# Altium project MRTRUMAN.PrjPcb (part 4 of 4)

## Sheet 07 Audio.SchDoc
size A
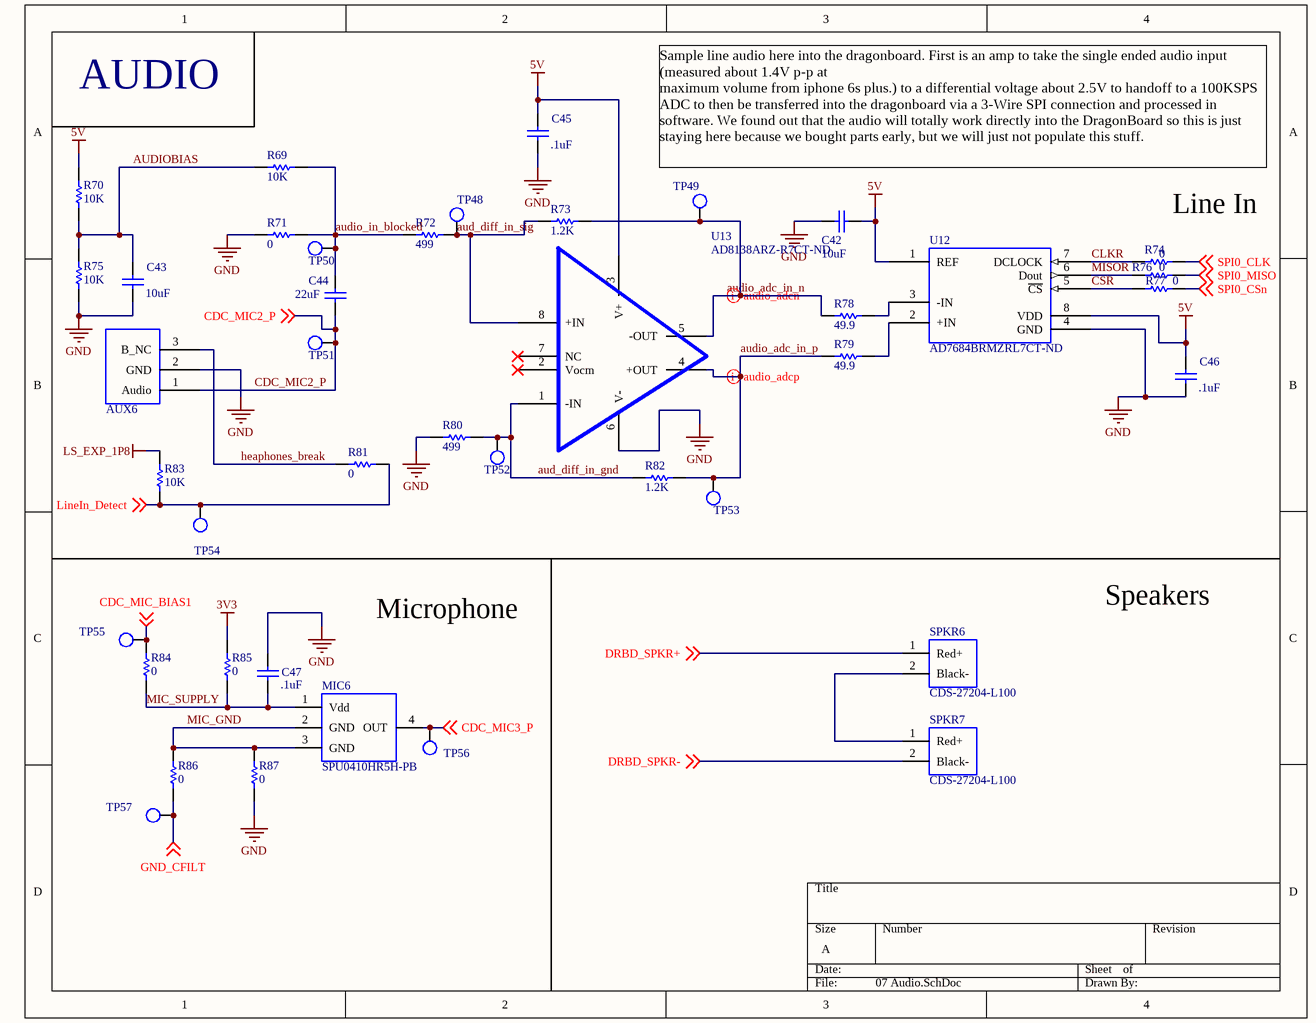
[diagram p6: 07 Audio.SchDoc]

### Parts
AUX6  CP-3523MJCT-ND  [Audio_Conn_Mono]  (value not drawn)
C42  value 10uF  [CAPC2012X135N]  (hidden comment: CAP_0805_10u_16V)
C43  value 10uF  [CAPC2012X135N]  (hidden comment: CAP_0805_10u_16V)
C44  value 22uF  [CAPC2012X135N]  (hidden comment: CAP_0805_22u_25V_BLOCK)
C45  value .1uF  [CAPC2012X135N]  (hidden comment: CAP_0805_.1u_250V)
C46  value .1uF  [CAPC2012X135N]  (hidden comment: CAP_0805_.1u_250V)
C47  value .1uF  [CAPC2012X135N]  (hidden comment: CAP_0805_.1u_250V)
MIC6  SPU0410HR5H-PB  [MIC_FP]
R69  Resistance: 10K  [RES0805]  (hidden comment: RES_0805_10K)
R70  Resistance: 10K  [RES0805]  (hidden comment: RES_0805_10K)
R71  RES_0805_JMP  [RES0805]  (value not drawn)
R72  Resistance: 499  [RES0805]  (hidden comment: RES_0805_499)
R73  Resistance: 1.2K  [RES0805]  (hidden comment: RES_0805_1.2K)
R74  RES_0805_JMP  [RES0805]  (value not drawn)
R75  Resistance: 10K  [RES0805]  (hidden comment: RES_0805_10K)
R76  RES_0805_JMP  [RES0805]  (value not drawn)
R77  RES_0805_JMP  [RES0805]  (value not drawn)
R78  Resistance: 49.9  [RES0805]  (hidden comment: RES_0805_49.9)
R79  Resistance: 49.9  [RES0805]  (hidden comment: RES_0805_49.9)
R80  Resistance: 499  [RES0805]  (hidden comment: RES_0805_499)
R81  RES_0805_JMP  [RES0805]  (value not drawn)
R82  Resistance: 1.2K  [RES0805]  (hidden comment: RES_0805_1.2K)
R83  Resistance: 10K  [RES0805]  (hidden comment: RES_0805_10K)
R84  RES_0805_JMP  [RES0805]  (value not drawn)
R85  RES_0805_JMP  [RES0805]  (value not drawn)
R86  RES_0805_JMP  [RES0805]  (value not drawn)
R87  RES_0805_JMP  [RES0805]  (value not drawn)
SPKR6  CDS-27204-L100  [PHOENIX_2POS_1935161]
SPKR7  CDS-27204-L100  [PHOENIX_2POS_1935161]
TP48  TP  [TestPoint_0805]  (value not drawn)
TP49  TP  [TestPoint_0805]  (value not drawn)
TP50  TP  [TestPoint_0805]  (value not drawn)
TP51  TP  [TestPoint_0805]  (value not drawn)
TP52  TP  [TestPoint_0805]  (value not drawn)
TP53  TP  [TestPoint_0805]  (value not drawn)
TP54  TP  [TestPoint_0805]  (value not drawn)
TP55  TP  [TestPoint_0805]  (value not drawn)
TP56  TP  [TestPoint_0805]  (value not drawn)
TP57  TP  [TestPoint_0805]  (value not drawn)
U12  AD7684BRMZRL7CT-ND  [MSOP8]
U13  AD8138ARZ-R7CT-ND  [SOIC127P600X175-8N]

### Nets
3V3: R85.2
5V: C42.1 C45.2 C46.2 R70.2 U12.1(REF) U12.8(VDD) U13.3(V+)
GND: AUX6.2(GND) C42.2 C43.1 C45.1 C46.1 C47.2 R71.1 R75.1 R80.1 R87.1 U12.4(GND) U13.6(V-)
LS_EXP_1P8: R83.2
aud_diff_in_gnd: R80.2 R82.1 TP52.1 U13.1(-IN)
aud_diff_in_sig: R72.2 R73.1 TP48.1 U13.8(+IN)
audio_adc_in_n: R73.2 R78.1 TP49.1 U13.5(-OUT)
audio_adc_in_p: R79.1 R82.2 TP53.1 U13.4(+OUT)
audio_in_blocked: C44.2 R69.2 R71.2 R72.1 TP50.1
AUDIOBIAS: C43.2 R69.1 R70.1 R75.2
CDC_MIC2_P: AUX6.1(Audio) C44.1 TP51.1 ; off-sheet CDC_MIC2_P
CDC_MIC3_P: MIC6.4(OUT) TP56.1 ; off-sheet CDC_MIC3_P
CDC_MIC_BIAS1: R84.2 TP55.1 ; off-sheet CDC_MIC_BIAS1
CLKR: R74.1 U12.7(DCLOCK)
CSR: R77.1 U12.5(~{CS})
DRBD_SPKR+: SPKR6.1(Red+) ; off-sheet DRBD_SPKR+
DRBD_SPKR-: SPKR7.2(Black-) ; off-sheet DRBD_SPKR-
GND_CFILT: R86.1 TP57.1 ; off-sheet GND_CFILT
heaphones_break: AUX6.3(B_NC) R81.1
LineIn_Detect: R81.2 R83.1 TP54.1 ; off-sheet LineIn_Detect
MIC_GND: MIC6.2(GND) MIC6.3(GND) R86.2 R87.2
MIC_SUPPLY: C47.1 MIC6.1(Vdd) R84.1 R85.1
MISOR: R76.1 U12.6(Dout)
SPI0_CLK: R74.2 ; off-sheet SPI0_CLK
SPI0_CSn: R77.2 ; off-sheet SPI0_CSn
SPI0_MISO: R76.2 ; off-sheet SPI0_MISO
NetR78_2: R78.2 U12.3(-IN)
NetR79_2: R79.2 U12.2(+IN)
NetSPKR6_2: SPKR6.2(Black-) SPKR7.1(Red+)

Not connected (* = marked no-connect by the designer): U13 2(Vocm)* 7(NC)*

### Layout directives
differential pair: audio_adc_in_n, audio_adc_in_p

### Notes on the sheet
- AUDIO
- Sample line audio here into the dragonboard. First is an amp to take the single ended audio input (measured about 1.4V p-p at
  maximum volume from iphone 6s plus.) to a differential voltage about 2.5V to handoff to a 100KSPS ADC to then be transferred into the dragonboard via a 3-Wire SPI connection and processed in software. We found out that the audio will totally work directly into the DragonBoard so this is just staying here because we bought parts early, but we will just not populate this stuff.
- Line In
- Microphone
- Speakers
- (in symbol RES_0805_JMP) 0

### Library data of the parts
AUX6 = CP-3523MJCT-ND: 3.50mm (0.141", 1/8", Mini Plug) - Headphone Phone Jack Mono Connector Solder; Manufacturer: CUI; Manufacturer Part Number: MJ-3523-SMT-TR; Gender: Female; Shielding: Unshielded; Current Rating: 1A; Supplier 1: Digi-Key; Stock 1: 44959; Pricing 1: 1=1.02, 10=0.9, 25=0.8476, 50=0.8122, 100=0.7768, 250=0.7062 (USD); Case/Package: SMD/SMT; Contact Plating: Silver; Packaging: Cut Tape; Termination: Solder; Lead Free: Lead Free; Supplier Part Number 1: CP-3523MJCT-ND
C42 C43 = CAP_0805_10u_16V: Cap Ceramic 10uF 16V X5R 10% SMD 0805 85C T/R; Manufacturer: Johanson Dielectrics; Manufacturer Part Number: 160R15X106KV4E; Supplier 1: Digi-Key; Supplier Part Number 1: 709-1229-1-ND; Stock 1: 36636; Pricing 1: 1=0.55, 10=0.387, 100=0.2552, 500=0.189, 1000=0.1607 (USD); Mount: Surface Mount; Case/Package: 0805; Number of Pins: 2; Weight: 0.000194oz; Case Code (Imperial): 0805; Case Code (Metric): 2012; Min Operating Temperature: -55°C; Max Operating Temperature: 85°C; Voltage Rating: 16V; Capacitance: 10uF; Voltage Rating (DC): 16V; Tolerance: 10%; Packaging: Tape and Reel; Package Quantity: 2000; Dielectric: X5R; Termination: SMD/SMT; Length: 2.03mm; Height: 1.27mm; Width: 1.27mm; Thickness: 0.06inch; Depth: 1.27mm; Radiation Hardening: No; REACH SVHC: No SVHC; ComponentLink1URL: https://datasheet.ciiva.com/26948/getdatasheetpartid-132904-26948555.pdf; ComponentLink1Description: https://datasheet.ciiva.com/26948/getdatasheetpartid-132904-26948555.pdf
C44 = CAP_0805_22u_25V_BLOCK: 22µF ±20% 25V X5R Ceramic Capacitor -55°C ~ 85°C Surface Mount, MLCC 0805 (2012 Metric) 0.079" L x 0.049" W (2.00mm x 1.25mm); Manufacturer: Samsung; Manufacturer Part Number: CL21A226MAQNNNE; Supplier 1: Digi-Key; Supplier Part Number 1: 1276-2908-1-ND; Stock 1: 536403; Pricing 1: 1=0.92, 10=0.678, 100=0.465, 500=0.3681, 1000=0.31 (USD); Mount: Surface Mount; Case/Package: 0805; Case Code (Metric): 2012; Case Code (Imperial): 0805; Contact Plating: Nickel,Tin; Min Operating Temperature: -55°C; Max Operating Temperature: 85°C; Package Quantity: 1; Packaging: Tape and Reel; Capacitance: 22uF; Tolerance: 20%; Voltage Rating: 25V; Dielectric: X5R; Termination: Wraparound; Length: 2mm; Width: 0.049inch; Thickness: 0.055inch; Depth: 1.25mm; ComponentLink1URL: https://datasheet.ciiva.com/25724/cl21a226maqnnne-25724468.pdf; ComponentLink1Description: https://datasheet.ciiva.com/25724/cl21a226maqnnne-25724468.pdf
C45-C47 = CAP_0805_.1u_250V: Cap Ceramic 0.1uF 250V X7T 10% SMD 0805 125C Plastic T/R; Manufacturer: TDK; Manufacturer Part Number: C2012X7T2E104K125AE; Capacitance: 100nF; Supplier 1: Digi-Key; Supplier Part Number 1: 445-8883-1-ND; Stock 1: 30376; Pricing 1: 1=0.37, 10=0.25, 100=0.1419, 500=0.1002, 1000=0.0877 (USD); Case/Package: 0805; Weight: 0.000194oz; Case Code (Metric): 2012; Case Code (Imperial): 0805; Min Operating Temperature: -55°C; Max Operating Temperature: 125°C; Package Quantity: 1; Voltage Rating: 250V; Tolerance: 10%; Packaging: Tape and Reel; Voltage Rating (DC): 250V; Dielectric: X7T; Termination: SMD/SMT; Composition: Ceramic; Length: 2mm; Height: 1.25mm; Width: 0.05inch; Thickness: 0.049inch; Depth: 1.25mm; REACH SVHC: No SVHC; ComponentLink1URL: https://datasheet.ciiva.com/24219/c2012x7t2e104k125ae-265154-24219519.pdf; ComponentLink1Description: https://datasheet.ciiva.com/24219/c2012x7t2e104k125ae-265154-24219519.pdf
MIC6 = SPU0410HR5H-PB: MIC MEMS ANALOG OMNI -42DB; Manufacturer: Knowles; Shape: Rectangular; Impedance: 300R; Voltage Rating: 3.6V; Direction: Omnidirectional; Operating Supply Current: 250uA; Signal to Noise Ratio (SNR): 59dB; Supplier 1: Digi-Key; Supplier Part Number 1: 423-1138-1-ND; Manufacturer Part Number: SPU0410HR5H-PB; Stock 1: 176050; Pricing 1: 1=0.94, 10=0.806, 25=0.6476, 50=0.5756, 100=0.5036, 250=0.4892, 500=0.4748 (USD); Package Quantity: 1200; Packaging: Tape and Reel; Termination: SMD/SMT; Length: 3.76mm; Height: 1.2mm; Width: 2.95mm; Depth: 1.2mm; ComponentLink1URL: https://datasheet.ciiva.com/5300/spu0410hr5h-58393-5300133.pdf; ComponentLink1Description: https://datasheet.ciiva.com/5300/spu0410hr5h-58393-5300133.pdf; ComponentLink2URL: https://datasheet.ciiva.com/1/spu0410hr5h-pb-1958.pdf; ComponentLink2Description: https://datasheet.ciiva.com/1/spu0410hr5h-pb-1958.pdf; ComponentLink3URL: https://datasheet.ciiva.com/1/spu0410hr5h-pb-1959.pdf; ComponentLink3Description: https://datasheet.ciiva.com/1/spu0410hr5h-pb-1959.pdf
R69 R70 R75 R83 = RES_0805_10K: RES, THICK FILM, 10K, 5%, 0.125W, 0805; Manufacturer: Yageo; Manufacturer Part Number: RC0805JR-0710KL; Power Rating: 125mW; Voltage Rating: 150V; Temperature Coefficient: 100ppm/°C; Supplier 1: Digi-Key; Stock 1: 1285290; Pricing 1: 1=0.1, 10=0.019, 100=0.0076, 1000=0.0034, 2500=0.003 (USD); Case/Package: 0805; Case Code (Imperial): 0805; Case Code (Metric): 2012; Contact Plating: Tin,Matte; Min Operating Temperature: -55°C; Max Operating Temperature: 155°C; Tolerance: 5%; Packaging: Tape and Reel; Termination: SMD/SMT; Composition: Thick Film; Military Standard: Not; Length: 2mm; Height: 0.5mm; Depth: 1.25mm; Width: 1.25mm; Radiation Hardening: No; REACH SVHC: Unknown; Lead Free: Lead Free; ComponentLink1URL: https://datasheet.ciiva.com/7983/444164-7983765.pdf; ComponentLink1Description: https://datasheet.ciiva.com/7983/444164-7983765.pdf; ComponentLink2URL: https://datasheet.ciiva.com/7941/444164-7941870.pdf; ComponentLink2Description: https://datasheet.ciiva.com/7941/444164-7941870.pdf; ComponentLink3URL: https://datasheet.ciiva.com/7941/444164-7941871.pdf; ComponentLink3Description: https://datasheet.ciiva.com/7941/444164-7941871.pdf; Supplier Part Number 1: 311-10KARCT-ND
R71 R74 R76 R77 R81 R84-R87 = RES_0805_JMP: RES, THICK FILM, 0R, 0.125W, 0805; Manufacturer: Yageo; Manufacturer Part Number: RC0805JR-070RL; Resistance: 0mR; Tolerance: 5%; Voltage Rating: 150V; Power Rating: 125mW; Temperature Coefficient: 200ppm/°C; Supplier 1: Digi-Key; Supplier Part Number 1: 311-0.0ARCT-ND; Stock 1: 6469744; Pricing 1: 1=0.1, 10=0.018, 25=0.0128, 50=0.0096, 100=0.0071, 250=0.0054, 500=0.0044, 1000=0.0032 (USD); Case/Package: 0805; Number of Pins: 2; Case Code (Imperial): 0805; Case Code (Metric): 2012; Contact Plating: Tin,Matte; Min Operating Temperature: -55°C; Max Operating Temperature: 155°C; Packaging: Tape and Reel; Voltage Rating (DC): 150V; Termination: SMD/SMT; Composition: Thick Film; Military Standard: Not; Length: 2mm; Height: 0.5mm; Width: 1.25mm; Depth: 1.25mm; Radiation Hardening: No; REACH SVHC: Unknown; Lead Free: Lead Free; ComponentLink1URL: https://datasheet.ciiva.com/7941/1738694-7941861.pdf; ComponentLink1Description: https://datasheet.ciiva.com/7941/1738694-7941861.pdf; ComponentLink2URL: https://datasheet.ciiva.com/7941/1738694-7941862.pdf; ComponentLink2Description: https://datasheet.ciiva.com/7941/1738694-7941862.pdf; ComponentLink3URL: https://datasheet.ciiva.com/11819/0900766b8106beab-11819430.pdf; ComponentLink3Description: https://datasheet.ciiva.com/11819/0900766b8106beab-11819430.pdf; ComponentLink4URL: https://datasheet.ciiva.com/7941/1738694-7941863.pdf; ComponentLink4Description: https://datasheet.ciiva.com/7941/1738694-7941863.pdf; ComponentLink5URL: https://datasheet.ciiva.com/15190/getdatasheetpartid-330685-15190028.pdf; ComponentLink5Description: https://datasheet.ciiva.com/15190/getdatasheetpartid-330685-15190028.pdf
R72 R80 = RES_0805_499: Res Thick Film 0805 499 Ohm 1% 0.125W(1/8W) ±100ppm/C Molded SMD Automotive T/R; Manufacturer: Stackpole Electronics; Manufacturer Part Number: RMCF0805FT499R; Power Rating: 125mW; Temperature Coefficient: 100ppm/°C; Supplier 1: Digi-Key; Stock 1: 258760; Pricing 1: 1=0.1, 10=0.023, 100=0.0095, 1000=0.0043, 2500=0.0037 (USD); Mount: Surface Mount; Case/Package: 0805; Case Code (Metric): 2012; Case Code (Imperial): 0805; Contact Plating: Tin,Matte; Min Operating Temperature: -55°C; Max Operating Temperature: 155°C; Tolerance: 1%; Packaging: Tape and Reel; Composition: Thick Film; Number of Terminations: 2; Military Standard: Not; Max Power Dissipation: 125mW; Length: 2mm; Height: 0.026inch; Width: 0.049inch; Depth: 1.25mm; Radiation Hardening: No; Lead Free: Lead Free; ComponentLink1URL: https://www.verical.com/server-webapp/html/getDatasheet?partID=363156; ComponentLink1Description: https://www.verical.com/server-webapp/html/getDatasheet?partID=363156; ComponentLink2URL: http://components.arrow.com/part/dataview/44988387S7171819N1174; ComponentLink2Description: http://components.arrow.com/part/dataview/44988387S7171819N1174; ComponentLink3URL: https://www.seielect.com/catalog/SEI-RMCF_RMCP.pdf; ComponentLink3Description: https://www.seielect.com/catalog/SEI-RMCF_RMCP.pdf; ComponentLink4URL: http://www.seielect.com/Catalog/SEI-RMC.pdf; ComponentLink4Description: http://www.seielect.com/Catalog/SEI-RMC.pdf; Supplier Part Number 1: RMCF0805FT499RCT-ND
R73 R82 = RES_0805_1.2K: Res Thick Film 0805 1.2K Ohm 5% 0.125W(1/8W) ±200ppm/C Molded SMD Automotive T/R; Manufacturer: Stackpole Electronics; Manufacturer Part Number: RMCF0805JT1K20; Max Power Dissipation: 125mW; Temperature Coefficient: 200ppm/°C; Supplier 1: Digi-Key; Stock 1: 133190; Pricing 1: 1=0.1, 10=0.017, 100=0.0067, 1000=0.003, 2500=0.0026 (USD); Mount: Surface Mount; Case/Package: 0805; Case Code (Metric): 2012; Case Code (Imperial): 0805; Contact Plating: Tin,Matte; Min Operating Temperature: -55°C; Max Operating Temperature: 155°C; Packaging: Tape and Reel; Tolerance: 5%; Composition: Thick Film; Number of Terminations: 2; Military Standard: Not; Length: 0.079inch; Height: 0.026inch; Width: 0.049inch; Depth: 1.25mm; Radiation Hardening: No; Lead Free: Lead Free; ComponentLink1URL: https://www.verical.com/server-webapp/html/getDatasheet?partID=408272; ComponentLink1Description: https://www.verical.com/server-webapp/html/getDatasheet?partID=408272; ComponentLink2URL: http://components.arrow.com/part/dataview/50565311S7077410N1174; ComponentLink2Description: http://components.arrow.com/part/dataview/50565311S7077410N1174; ComponentLink3URL: https://www.seielect.com/catalog/SEI-RMCF_RMCP.pdf; ComponentLink3Description: https://www.seielect.com/catalog/SEI-RMCF_RMCP.pdf; Supplier Part Number 1: RMCF0805JT1K20CT-ND
R78 R79 = RES_0805_49.9: RES SMD 49.9 OHM 1% 1/8W 0805; Manufacturer: Yageo; Manufacturer Part Number: RC0805FR-0749R9L; Power Rating: 125mW; Voltage Rating: 150V; Temperature Coefficient: 100ppm/°C; Supplier 1: Digi-Key; Stock 1: 531225; Pricing 1: 1=0.1, 10=0.022, 100=0.0088, 1000=0.004, 2500=0.0034 (USD); Mount: Surface Mount; Case/Package: 0805; Case Code (Metric): 2012; Case Code (Imperial): 0805; Min Operating Temperature: -55°C; Max Operating Temperature: 155°C; Package Quantity: 1; Tolerance: 1%; Packaging: Tape and Reel; Composition: Thick Film; Number of Terminations: 2; Termination: SMD/SMT; Military Standard: Not; Max Power Dissipation: 125mW; Voltage Rating (DC): 150V; Length: 2mm; Height: 0.024inch; Width: 0.049inch; Depth: 1.25mm; Lead Free: Lead Free; ComponentLink1URL: https://datasheet.ciiva.com/11808/0900766b8106beab-11808260.pdf; ComponentLink1Description: https://datasheet.ciiva.com/11808/0900766b8106beab-11808260.pdf; ComponentLink2URL: https://datasheet.ciiva.com/12667/rc0805-12667333.pdf; ComponentLink2Description: https://datasheet.ciiva.com/12667/rc0805-12667333.pdf; ComponentLink3URL: https://datasheet.ciiva.com/17041/rc0805-17041420.pdf; ComponentLink3Description: https://datasheet.ciiva.com/17041/rc0805-17041420.pdf; Supplier Part Number 1: 311-49.9CRCT-ND
SPKR6 SPKR7 = CDS-27204-L100: 4 Ohm Magnetic Speaker 2W 20Hz ~ 20kHz Top Rectangular 93dB; Manufacturer: CUI; Impedance: 4R; Max Power Dissipation: 2.5W; Max Current Rating: 16A; Max Supply Voltage: 250V; Number of Poles: 2; Number of Levels: 1; Current: 18A; Voltage: 300V; Voltage Rating (DC): 320V; Connector Type: Screw; Wire Gauge (Max): 26AWG; Wire Gauge (Min): 12AWG; Pitch: 5mm; Wire/Cable Gauge: 14AWG; Approvals: UL; Supplier 1: Digi-Key; Manufacturer Part Number: CDS-27204-L100; Stock 1: 445; Pricing 1: 1=3.55, 10=3.179, 25=2.8052, 50=2.5246, 100=2.4871, 250=2.3842, 500=2.2908, 1000=2.244 (USD); Shape: Rectangular; Power Rating: 2W; Termination: Wire Leads; Length: 27mm; Height: 6.1mm; Width: 20mm; Lead Free: Lead Free; Supplier Part Number 1: 102-3547-ND; Supplier 2: Digi-Key; Stock 2: 16172; Pricing 2: 1=0.38, 10=0.368, 50=0.352, 100=0.3424, 250=0.32, 500=0.2944, 1000=0.272 (USD); Mount: Through Hole; Weight: 0.067021oz; Colour: Green; Material: Nylon; Housing Colour: Green; Housing Material: Polyamide; Insulation Material: Nylon; Number of Rows: 1; Current Rating: 16A; Voltage Rating: 250V; Package Quantity: 250; Packaging: Bulk; Number of Positions: 2; Number of Positions Per Level: 2; Number of Contacts: 2; Number of Circuits: 2; Orientation: Straight; Depth: 9mm; Radiation Hardening: No; Flammability Rating: UL94 V-0; ComponentLink1URL: https://datasheet.ciiva.com/824/combiconcompact5-0mmseries-824222.pdf; ComponentLink1Description: https://datasheet.ciiva.com/824/combiconcompact5-0mmseries-824222.pdf; ComponentLink2URL: https://datasheet.ciiva.com/15169/getdatasheetpartid-177903-15169663.pdf; ComponentLink2Description: https://datasheet.ciiva.com/15169/getdatasheetpartid-177903-15169663.pdf; ComponentLink3URL: https://datasheet.ciiva.com/16047/1935161-16047247.pdf; ComponentLink3Description: https://datasheet.ciiva.com/16047/1935161-16047247.pdf; Supplier Part Number 2: 277-1667-ND
TP48-TP57 = TP: Testpoint_0805; Manufacturer: TE Connectivity; Manufacturer Part Number: 1625854-2; Resistance: 0mR; Supplier 1: Digi-Key; Stock 1: 27299; Pricing 1: 1=0.21, 10=0.2, 25=0.1708, 50=0.1496, 100=0.1389, 250=0.1229, 500=0.1175, 1000=0.0962 (USD); Case/Package: 0805; Colour: Natural; Min Operating Temperature: -55°C; Max Operating Temperature: 125°C; Packaging: Tape and Reel; Package Quantity: 2000; Military Standard: Not; Length: 2mm; Depth: 1.2mm; Radiation Hardening: No; Lead Free: Lead Free; ComponentLink1URL: https://datasheet.ciiva.com/6439/eng-ds-1773266-a-6439169.pdf; ComponentLink1Description: https://datasheet.ciiva.com/6439/eng-ds-1773266-a-6439169.pdf; ComponentLink2URL: https://datasheet.ciiva.com/30238/1773266-a-30238966.pdf; ComponentLink2Description: https://datasheet.ciiva.com/30238/1773266-a-30238966.pdf; ComponentLink3URL: https://datasheet.ciiva.com/8914/eng-ds-1773266-a-8914649.pdf; ComponentLink3Description: https://datasheet.ciiva.com/8914/eng-ds-1773266-a-8914649.pdf; Supplier Part Number 1: A106144CT-ND; Mount: Surface Mount
U12 = AD7684BRMZRL7CT-ND: IC ADC 16BIT 100KSPS DIFF 8MSOP; Manufacturer: Analog Devices; Max Power Dissipation: 6mW; Supply Voltage: 5V; Min Supply Voltage: 2.7V; Max Supply Voltage: 5.5V; Number of Channels: 1; Interface: SPI; Power Consumption: 4mW; Resolution: 16b; Sampling Rate: 100KS/s; Signal to Noise Ratio (SNR): 91dB; Number of Bits: 16; Polarity: Bipolar; Supply Type: Single; Integral Nonlinearity (INL): 3LSB; Input Capacitance: 30pF; Full Scale Error: 15LSB; Min Input Voltage: 500mV; Supplier 1: Digi-Key; Manufacturer Part Number: AD7684BRMZRL7; Stock 1: 2500; Pricing 1: 1=14.81, 10=13.613, 100=11.4968 (USD); Case/Package: MSOP; Number of Pins: 8; Contact Plating: Gold; Min Operating Temperature: -40°C; Max Operating Temperature: 85°C; Package Quantity: 1000; Packaging: Tape and Reel; Number of Converters: 1; Number of Inputs: 1; Number of A/D Converters: 1; Number of Analog Inputs: 1; Number of Elements: 1; Power Dissipation: 6mW; Max Input Voltage: 5.5V; Length: 3mm; Height: 0.85mm; Width: 3mm; Lead Free: Contains Lead; ComponentLink1URL: https://datasheet.ciiva.com/16322/ad7684-278579-16322642.pdf; ComponentLink1Description: https://datasheet.ciiva.com/16322/ad7684-278579-16322642.pdf; ComponentLink2URL: https://datasheet.ciiva.com/8195/ad7684-8195814.pdf; ComponentLink2Description: https://datasheet.ciiva.com/8195/ad7684-8195814.pdf; ComponentLink3URL: https://datasheet.ciiva.com/1287/ad7684-1287305.pdf; ComponentLink3Description: https://datasheet.ciiva.com/1287/ad7684-1287305.pdf; ComponentLink4URL: https://datasheet.ciiva.com/16612/ad7684-16612158.pdf; ComponentLink4Description: https://datasheet.ciiva.com/16612/ad7684-16612158.pdf; Supplier Part Number 1: AD7684BRMZRL7CT-ND
U13 = AD8138ARZ-R7CT-ND: SP Amp Differential ADC Driver Single ±5.5V/11V 8-Pin SOIC N T/R; Manufacturer: Analog Devices; Min Supply Voltage: 2.7V; Max Supply Voltage: 11V; Min Dual Supply Voltage: 1.4V; Max Dual Supply Voltage: 5.5V; Common Mode Rejection Ratio: 70dB; Number of Channels: 1; Bandwidth: 320MHz; Slew Rate: 1150V/µs; Nominal Supply Current: 20mA; Max Power Dissipation: 550mW; Input Offset Voltage (Vos): 1mV; Input Bias Current: 7uA; Voltage Gain: 0.028dB; Input Resistance: 6MR; Supplier 1: Digi-Key; Manufacturer Part Number: AD8138ARZ-R7; Stock 1: 0; Pricing 1: 1=9.26, 10=8.365, 100=6.9255, 500=6.0306 (USD); Mount: Surface Mount; Case/Package: SOIC; Number of Pins: 8; Min Operating Temperature: -40°C; Max Operating Temperature: 85°C; Package Quantity: 1000; Packaging: Tape and Reel; Operating Supply Current: 20mA; Power Supply Rejection Ratio (PSRR): 70dB; Number of Elements: 1; Power Dissipation: 550mW; Gain Bandwidth Product: 320MHz; Number of Circuits: 1; -3db Bandwidth: 320MHz; Radiation Hardening: No; Lead Free: Contains Lead; ComponentLink1URL: https://datasheet.ciiva.com/2975/ad8138-2975957.pdf; ComponentLink1Description: https://datasheet.ciiva.com/2975/ad8138-2975957.pdf; ComponentLink2URL: https://datasheet.ciiva.com/14848/ad8138-14848182.pdf; ComponentLink2Description: https://datasheet.ciiva.com/14848/ad8138-14848182.pdf; ComponentLink3URL: https://datasheet.ciiva.com/7615/ad8138-7615959.pdf; ComponentLink3Description: https://datasheet.ciiva.com/7615/ad8138-7615959.pdf; ComponentLink4URL: https://datasheet.ciiva.com/14848/ad8138-14848183.pdf; ComponentLink4Description: https://datasheet.ciiva.com/14848/ad8138-14848183.pdf; ComponentLink5URL: https://datasheet.ciiva.com/17371/ad8138-17371687.pdf; ComponentLink5Description: https://datasheet.ciiva.com/17371/ad8138-17371687.pdf; ComponentLink6URL: https://datasheet.ciiva.com/15128/getdatasheetpartid-86354-15128216.pdf; ComponentLink6Description: https://datasheet.ciiva.com/15128/getdatasheetpartid-86354-15128216.pdf; ComponentLink7URL: https://datasheet.ciiva.com/2975/ad8138-2975645.pdf; ComponentLink7Description: https://datasheet.ciiva.com/2975/ad8138-2975645.pdf; ComponentLink8URL: https://datasheet.ciiva.com/15382/ad8138-246651-15382031.pdf; ComponentLink8Description: https://datasheet.ciiva.com/15382/ad8138-246651-15382031.pdf; Supplier Part Number 1: AD8138ARZ-R7CT-ND

## Sheet 08 Camera.SchDoc
size 177 x 152 mm
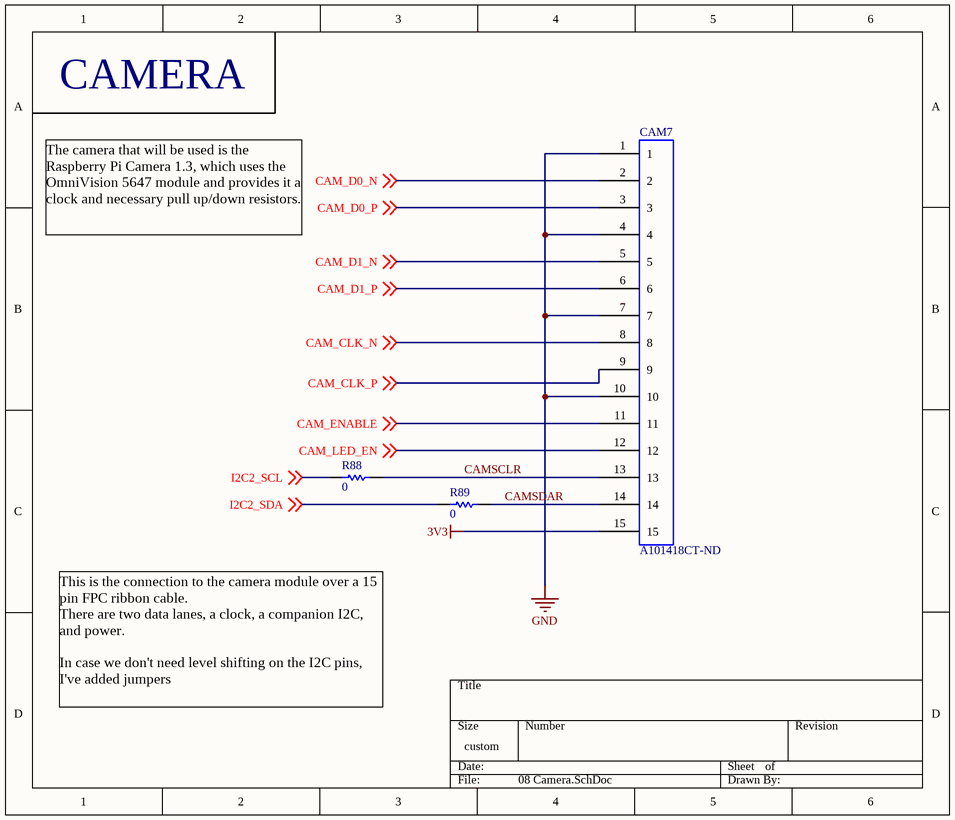
[diagram p7: 08 Camera.SchDoc]

### Parts
CAM7  A101418CT-ND  [ZIF_15pin]
R88  RES_0805_JMP  [RES0805]  (value not drawn)
R89  RES_0805_JMP  [RES0805]  (value not drawn)

### Nets
3V3: CAM7.15
GND: CAM7.1 CAM7.4 CAM7.7 CAM7.10
CAM_CLK_N: CAM7.8 ; off-sheet CAM_CLK_N
CAM_CLK_P: CAM7.9 ; off-sheet CAM_CLK_P
CAM_D0_N: CAM7.2 ; off-sheet CAM_D0_N
CAM_D0_P: CAM7.3 ; off-sheet CAM_D0_P
CAM_D1_N: CAM7.5 ; off-sheet CAM_D1_N
CAM_D1_P: CAM7.6 ; off-sheet CAM_D1_P
CAM_ENABLE: CAM7.11 ; off-sheet CAM_ENABLE
CAM_LED_EN: CAM7.12 ; off-sheet CAM_LED_EN
CAMSCLR: CAM7.13 R88.2
CAMSDAR: CAM7.14 R89.2
I2C2_SCL: R88.1 ; off-sheet I2C2_SCL
I2C2_SDA: R89.1 ; off-sheet I2C2_SDA

### Notes on the sheet
- CAMERA
- The camera that will be used is the Raspberry Pi Camera 1.3, which uses the OmniVision 5647 module and provides it a clock and necessary pull up/down resistors.
- This is the connection to the camera module over a 15 pin FPC ribbon cable.
  There are two data lanes, a clock, a companion I2C, and power.
  In case we don't need level shifting on the I2C pins, I've added jumpers
- (in symbol RES_0805_JMP) 0

### Library data of the parts
CAM7 = A101418CT-ND: CONN FPC VERT 15POS 1.00MM SMD; Manufacturer: TE Connectivity; Manufacturer Part Number: 1-1734248-5; Current Rating: 1A; Voltage Rating: 125V; Gender: Receptacle; Number of Positions: 15; Shielding: Unshielded; Connector Type: Connector,Receptacle,Socket; Wire/Cable Type: Flat Flex; Connector System: Flex-to-Board; Mating Alignment: Yes (With); PCB Mount Alignment: No (Without); PCB Mount Retention: With; PCB Mounting Orientation: Vertical; Pitch: 0.039inch; Supplier 1: Digi-Key; Stock 1: 14321; Pricing 1: 1=1.67, 10=1.515, 25=1.4224, 50=1.3606, 100=1.2988, 250=1.1751, 500=1.0824 (USD); Mount: Surface Mount; Case/Package: SMD/SMT; Contact Plating: Gold; Contact Material: Bronze; Housing Colour: Black; Housing Material: Thermoplastic; Min Operating Temperature: -4°C; Max Operating Temperature: 185°C; Package Quantity: 1000; Packaging: Tape and Reel; Number of Rows: 1; Termination: SMD/SMT; Number of Contacts: 15; Orientation: Straight; Max Current Rating: 1A; Sealable: No (Without); Shrouded: Yes (With); Length: 22.4mm; Height: 7.7mm; Width: 4.6mm; Depth: 4.6mm; REACH SVHC: Unknown; ELV: Compliant; Flammability Rating: UL94 V-0; ComponentLink1URL: https://datasheet.ciiva.com/672/eng-cd-1734248-e1-672176.pdf; ComponentLink1Description: https://datasheet.ciiva.com/672/eng-cd-1734248-e1-672176.pdf; ComponentLink2URL: https://datasheet.ciiva.com/672/eng-cd-1734248-e1-672177.pdf; ComponentLink2Description: https://datasheet.ciiva.com/672/eng-cd-1734248-e1-672177.pdf; ComponentLink3URL: https://datasheet.ciiva.com/672/eng-cd-1734248-e1-672178.pdf; ComponentLink3Description: https://datasheet.ciiva.com/672/eng-cd-1734248-e1-672178.pdf; ComponentLink4URL: https://datasheet.ciiva.com/7989/eng-ds-1-1773440-6-0506-7989477.pdf; ComponentLink4Description: https://datasheet.ciiva.com/7989/eng-ds-1-1773440-6-0506-7989477.pdf; ComponentLink5URL: https://datasheet.ciiva.com/16660/eng-ds-1-1773440-6-0506-16660185.pdf; ComponentLink5Description: https://datasheet.ciiva.com/16660/eng-ds-1-1773440-6-0506-16660185.pdf; Supplier Part Number 1: A101418CT-ND
R88 R89 = RES_0805_JMP: as R71 on sheet 07 Audio; Supplier 1: Digi-Key; Supplier Part Number 1: 311-0.0ARCT-ND; Stock 1: 6469744; Pricing 1: 1=0.1, 10=0.018, 25=0.0128, 50=0.0096, 100=0.0071, 250=0.0054, 500=0.0044, 1000=0.0032 (USD); Case/Package: 0805; Number of Pins: 2; Case Code (Imperial): 0805; Case Code (Metric): 2012; Contact Plating: Tin,Matte; Min Operating Temperature: -55°C; Max Operating Temperature: 155°C; Packaging: Tape and Reel; Voltage Rating (DC): 150V; Termination: SMD/SMT; Composition: Thick Film; Military Standard: Not; Length: 2mm; Height: 0.5mm; Width: 1.25mm; Depth: 1.25mm; Radiation Hardening: No; REACH SVHC: Unknown; Lead Free: Lead Free; ComponentLink1URL: https://datasheet.ciiva.com/7941/1738694-7941861.pdf; ComponentLink1Description: https://datasheet.ciiva.com/7941/1738694-7941861.pdf; ComponentLink2URL: https://datasheet.ciiva.com/7941/1738694-7941862.pdf; ComponentLink2Description: https://datasheet.ciiva.com/7941/1738694-7941862.pdf; ComponentLink3URL: https://datasheet.ciiva.com/11819/0900766b8106beab-11819430.pdf; ComponentLink3Description: https://datasheet.ciiva.com/11819/0900766b8106beab-11819430.pdf; ComponentLink4URL: https://datasheet.ciiva.com/7941/1738694-7941863.pdf; ComponentLink4Description: https://datasheet.ciiva.com/7941/1738694-7941863.pdf; ComponentLink5URL: https://datasheet.ciiva.com/15190/getdatasheetpartid-330685-15190028.pdf; ComponentLink5Description: https://datasheet.ciiva.com/15190/getdatasheetpartid-330685-15190028.pdf

## Sheet 09 LEDs(2).SchDoc
size A
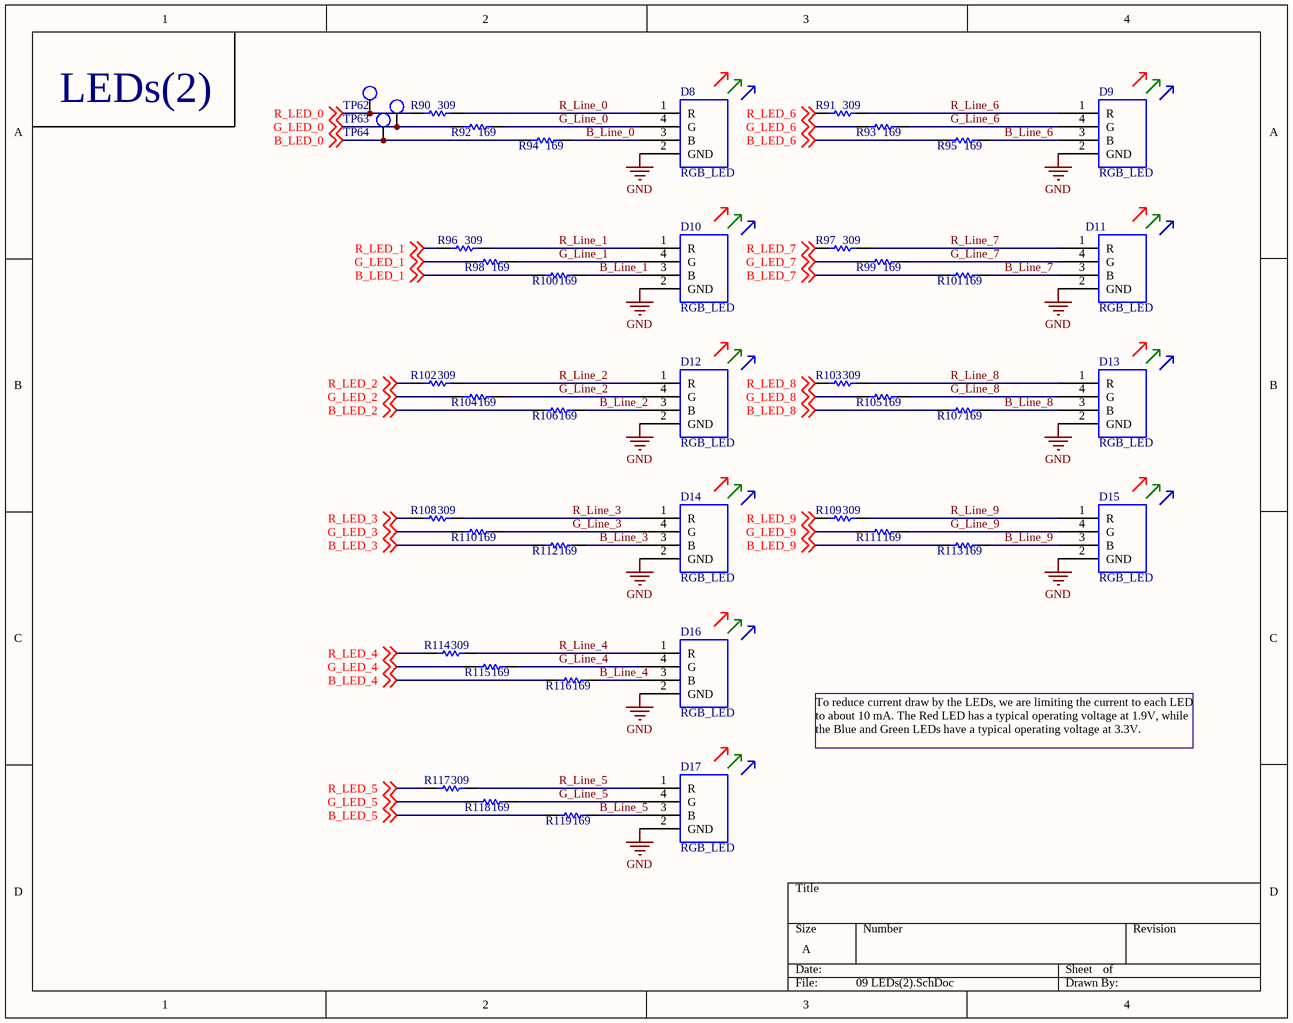
[diagram p8: 09 LEDs(2).SchDoc]

### Parts
D8  RGB_LED  [RGB_LED]
D9  RGB_LED  [RGB_LED]
D10  RGB_LED  [RGB_LED]
D11  RGB_LED  [RGB_LED]
D12  RGB_LED  [RGB_LED]
D13  RGB_LED  [RGB_LED]
D14  RGB_LED  [RGB_LED]
D15  RGB_LED  [RGB_LED]
D16  RGB_LED  [RGB_LED]
D17  RGB_LED  [RGB_LED]
R90  RES_0805_309  [RES0805]  (value not drawn)
R91  RES_0805_309  [RES0805]  (value not drawn)
R92  169 Ohm  [RES0805]  (value not drawn)
R93  169 Ohm  [RES0805]  (value not drawn)
R94  169 Ohm  [RES0805]  (value not drawn)
R95  169 Ohm  [RES0805]  (value not drawn)
R96  RES_0805_309  [RES0805]  (value not drawn)
R97  RES_0805_309  [RES0805]  (value not drawn)
R98  169 Ohm  [RES0805]  (value not drawn)
R99  169 Ohm  [RES0805]  (value not drawn)
R100  169 Ohm  [RES0805]  (value not drawn)
R101  169 Ohm  [RES0805]  (value not drawn)
R102  RES_0805_309  [RES0805]  (value not drawn)
R103  RES_0805_309  [RES0805]  (value not drawn)
R104  169 Ohm  [RES0805]  (value not drawn)
R105  169 Ohm  [RES0805]  (value not drawn)
R106  169 Ohm  [RES0805]  (value not drawn)
R107  169 Ohm  [RES0805]  (value not drawn)
R108  RES_0805_309  [RES0805]  (value not drawn)
R109  RES_0805_309  [RES0805]  (value not drawn)
R110  169 Ohm  [RES0805]  (value not drawn)
R111  169 Ohm  [RES0805]  (value not drawn)
R112  169 Ohm  [RES0805]  (value not drawn)
R113  169 Ohm  [RES0805]  (value not drawn)
R114  RES_0805_309  [RES0805]  (value not drawn)
R115  169 Ohm  [RES0805]  (value not drawn)
R116  169 Ohm  [RES0805]  (value not drawn)
R117  RES_0805_309  [RES0805]  (value not drawn)
R118  169 Ohm  [RES0805]  (value not drawn)
R119  169 Ohm  [RES0805]  (value not drawn)
TP62  TP  [TestPoint_0805]  (value not drawn)
TP63  TP  [TestPoint_0805]  (value not drawn)
TP64  TP  [TestPoint_0805]  (value not drawn)

### Nets
GND: D8.2(GND) D9.2(GND) D10.2(GND) D11.2(GND) D12.2(GND) D13.2(GND) D14.2(GND) D15.2(GND) D16.2(GND) D17.2(GND)
B_LED_0: R94.1 TP64.1 ; off-sheet B_LED_0
B_LED_1: R100.1 ; off-sheet B_LED_1
B_LED_2: R106.1 ; off-sheet B_LED_2
B_LED_3: R112.1 ; off-sheet B_LED_3
B_LED_4: R116.1 ; off-sheet B_LED_4
B_LED_5: R119.1 ; off-sheet B_LED_5
B_LED_6: R95.1 ; off-sheet B_LED_6
B_LED_7: R101.1 ; off-sheet B_LED_7
B_LED_8: R107.1 ; off-sheet B_LED_8
B_LED_9: R113.1 ; off-sheet B_LED_9
B_Line_0: D8.3(B) R94.2
B_Line_1: D10.3(B) R100.2
B_Line_2: D12.3(B) R106.2
B_Line_3: D14.3(B) R112.2
B_Line_4: D16.3(B) R116.2
B_Line_5: D17.3(B) R119.2
B_Line_6: D9.3(B) R95.2
B_Line_7: D11.3(B) R101.2
B_Line_8: D13.3(B) R107.2
B_Line_9: D15.3(B) R113.2
G_LED_0: R92.1 TP63.1 ; off-sheet G_LED_0
G_LED_1: R98.1 ; off-sheet G_LED_1
G_LED_2: R104.1 ; off-sheet G_LED_2
G_LED_3: R110.1 ; off-sheet G_LED_3
G_LED_4: R115.1 ; off-sheet G_LED_4
G_LED_5: R118.1 ; off-sheet G_LED_5
G_LED_6: R93.1 ; off-sheet G_LED_6
G_LED_7: R99.1 ; off-sheet G_LED_7
G_LED_8: R105.1 ; off-sheet G_LED_8
G_LED_9: R111.1 ; off-sheet G_LED_9
G_Line_0: D8.4(G) R92.2
G_Line_1: D10.4(G) R98.2
G_Line_2: D12.4(G) R104.2
G_Line_3: D14.4(G) R110.2
G_Line_4: D16.4(G) R115.2
G_Line_5: D17.4(G) R118.2
G_Line_6: D9.4(G) R93.2
G_Line_7: D11.4(G) R99.2
G_Line_8: D13.4(G) R105.2
G_Line_9: D15.4(G) R111.2
R_LED_0: R90.1 TP62.1 ; off-sheet R_LED_0
R_LED_1: R96.1 ; off-sheet R_LED_1
R_LED_2: R102.1 ; off-sheet R_LED_2
R_LED_3: R108.1 ; off-sheet R_LED_3
R_LED_4: R114.1 ; off-sheet R_LED_4
R_LED_5: R117.1 ; off-sheet R_LED_5
R_LED_6: R91.1 ; off-sheet R_LED_6
R_LED_7: R97.1 ; off-sheet R_LED_7
R_LED_8: R103.1 ; off-sheet R_LED_8
R_LED_9: R109.1 ; off-sheet R_LED_9
R_Line_0: D8.1(R) R90.2
R_Line_1: D10.1(R) R96.2
R_Line_2: D12.1(R) R102.2
R_Line_3: D14.1(R) R108.2
R_Line_4: D16.1(R) R114.2
R_Line_5: D17.1(R) R117.2
R_Line_6: D9.1(R) R91.2
R_Line_7: D11.1(R) R97.2
R_Line_8: D13.1(R) R103.2
R_Line_9: D15.1(R) R109.2

### Notes on the sheet
- LEDs(2)
- To reduce current draw by the LEDs, we are limiting the current to each LED to about 10 mA. The Red LED has a typical operating voltage at 1.9V, while the Blue and Green LEDs have a typical operating voltage at 3.3V.
- (in symbol RES_0805_169) 169
- (in symbol RES_0805_309) 309

### Library data of the parts
D8-D17 = RGB_LED: WP154A4SUREQBFZGC; Manufacturer: Kingbright; Colour: Blue,Green,Red; Luminous Intensity: 900mcd; Lens Style: Dome,Clear; Forward Current: 20mA; Forward Voltage: 3.3V; Viewing Angle: 50°; Dominant Wavelength: 465nm; Supplier 1: Digi-Key; Manufacturer Part Number: WP154A4SUREQBFZGC; Stock 1: 8274; Pricing 1: 1=1.89, 10=1.534, 25=1.18, 100=1.062, 250=0.944, 500=0.8024, 1000=0.6608, 2500=0.6278, 5000=0.6136 (USD); Mount: Through Hole; Case/Package: Radial; Min Operating Temperature: -40°C; Max Operating Temperature: 85°C; Packaging: Bulk; Package Quantity: 500; Test Current: 20mA; Height: 8.6mm; Lead Free: Lead Free; ComponentLink1URL: https://datasheet.ciiva.com/6349/wp154a4sureqbfzgc-6349426.pdf; ComponentLink1Description: https://datasheet.ciiva.com/6349/wp154a4sureqbfzgc-6349426.pdf; ComponentLink2URL: https://datasheet.ciiva.com/13501/wp154a4sureqbfzgc-194997-13501708.pdf; ComponentLink2Description: https://datasheet.ciiva.com/13501/wp154a4sureqbfzgc-194997-13501708.pdf; Supplier Part Number 1: 754-1615-ND
R90 R91 R96 R97 R102 R103 R108 R109 R114 R117 = RES_0805_309: RES SMD 309 OHM 1% 1/8W 0805; Manufacturer: Yageo; Manufacturer Part Number: RC0805FR-07309RL; Resistance: 309R; Temperature Coefficient: 100ppm/°C; Power Rating: 125mW; Voltage Rating: 150V; Supplier 1: Digi-Key; Stock 1: 22039; Pricing 1: 1=0.1, 10=0.022, 100=0.0088, 1000=0.004, 2500=0.0034 (USD); Case/Package: 0805; Contact Plating: Tin,Lead,Matte; Case Code (Imperial): 0805; Case Code (Metric): 2012; Min Operating Temperature: -55°C; Max Operating Temperature: 155°C; Tolerance: 1%; Composition: Thick Film; Packaging: Tape and Reel; Package Quantity: 1; Termination: SMD/SMT; Number of Terminations: 2; Military Standard: Not; Max Power Dissipation: 125mW; Voltage Rating (DC): 150V; Length: 2mm; Height: 0.024inch; Width: 1.25mm; Depth: 1.25mm; Radiation Hardening: No; Lead Free: Lead Free; ComponentLink1URL: https://datasheet.ciiva.com/2457/pyu-r-int-thick-7-2457593.pdf; ComponentLink1Description: https://datasheet.ciiva.com/2457/pyu-r-int-thick-7-2457593.pdf; ComponentLink2URL: https://datasheet.ciiva.com/2457/pyu-r-int-thick-7-2457594.pdf; ComponentLink2Description: https://datasheet.ciiva.com/2457/pyu-r-int-thick-7-2457594.pdf; ComponentLink3URL: https://datasheet.ciiva.com/2457/pyu-r-int-thick-7-2457595.pdf; ComponentLink3Description: https://datasheet.ciiva.com/2457/pyu-r-int-thick-7-2457595.pdf; Supplier Part Number 1: 311-309CRCT-ND
R92-R95 R98-R101 R104-R107 R110-R113 R115 R116 R118 R119 = RES_0805_169: RES SMD 169 OHM 1% 1/8W 0805; Manufacturer: Yageo; Manufacturer Part Number: RC0805FR-07169RL; Resistance: 169R; Temperature Coefficient: 100ppm/°C; Power Rating: 125mW; Voltage Rating: 150V; Supplier 1: Digi-Key; Stock 1: 54311; Pricing 1: 1=0.1, 10=0.022, 100=0.0088, 1000=0.004, 2500=0.0034 (USD); Case/Package: 0805; Contact Plating: Tin,Matte; Case Code (Metric): 2012; Case Code (Imperial): 0805; Min Operating Temperature: -55°C; Max Operating Temperature: 155°C; Tolerance: 1%; Composition: Thick Film; Packaging: Tape and Reel; Package Quantity: 1; Number of Terminations: 2; Termination: SMD/SMT; Military Standard: Not; Max Power Dissipation: 125mW; Voltage Rating (DC): 150V; Length: 2mm; Height: 0.024inch; Width: 0.049inch; Depth: 1.25mm; Radiation Hardening: No; Lead Free: Lead Free; ComponentLink1URL: https://datasheet.ciiva.com/17054/rc0805-17054266.pdf; ComponentLink1Description: https://datasheet.ciiva.com/17054/rc0805-17054266.pdf; ComponentLink2URL: https://datasheet.ciiva.com/2509/pyu-r-int-thick-7-2509468.pdf; ComponentLink2Description: https://datasheet.ciiva.com/2509/pyu-r-int-thick-7-2509468.pdf; ComponentLink3URL: https://datasheet.ciiva.com/2509/pyu-r-int-thick-7-2509469.pdf; ComponentLink3Description: https://datasheet.ciiva.com/2509/pyu-r-int-thick-7-2509469.pdf; ComponentLink4URL: https://datasheet.ciiva.com/2509/pyu-r-int-thick-7-2509470.pdf; ComponentLink4Description: https://datasheet.ciiva.com/2509/pyu-r-int-thick-7-2509470.pdf; Supplier Part Number 1: 311-169CRCT-ND
TP62-TP64 = TP: as TP48 on sheet 07 Audio; Supplier 1: Digi-Key; Stock 1: 27299; Pricing 1: 1=0.21, 10=0.2, 25=0.1708, 50=0.1496, 100=0.1389, 250=0.1229, 500=0.1175, 1000=0.0962 (USD); Case/Package: 0805; Colour: Natural; Min Operating Temperature: -55°C; Max Operating Temperature: 125°C; Packaging: Tape and Reel; Package Quantity: 2000; Military Standard: Not; Length: 2mm; Depth: 1.2mm; Radiation Hardening: No; Lead Free: Lead Free; ComponentLink1URL: https://datasheet.ciiva.com/6439/eng-ds-1773266-a-6439169.pdf; ComponentLink1Description: https://datasheet.ciiva.com/6439/eng-ds-1773266-a-6439169.pdf; ComponentLink2URL: https://datasheet.ciiva.com/30238/1773266-a-30238966.pdf; ComponentLink2Description: https://datasheet.ciiva.com/30238/1773266-a-30238966.pdf; ComponentLink3URL: https://datasheet.ciiva.com/8914/eng-ds-1773266-a-8914649.pdf; ComponentLink3Description: https://datasheet.ciiva.com/8914/eng-ds-1773266-a-8914649.pdf; Supplier Part Number 1: A106144CT-ND; Mount: Surface Mount

## Nets that join several sheets
3V3: 03 POWER (10 pins), 04 DragonBoard_INTF (C28.2 U8.19), 06 Gyro (5 pins), 07 Audio (R85.2), 08 Camera (CAM7.15)
5V: 02 LEDs (12 pins), 03 POWER (14 pins), 04 DragonBoard_INTF (C32.2 U9.19), 05 SERVO_FAN (7 pins), 07 Audio (7 pins)
12V_BATTIN: 03 POWER (18 pins), 04 DragonBoard_INTF (J3.36 J3.38)
GND: 02 LEDs (27 pins), 03 POWER (41 pins), 04 DragonBoard_INTF (36 pins), 05 SERVO_FAN (14 pins), 06 Gyro (7 pins), 07 Audio (12 pins), 08 Camera (CAM7.1 CAM7.4 CAM7.7 CAM7.10), 09 LEDs(2) (10 pins)
LS_EXP_1P8: 03 POWER (R44.2), 04 DragonBoard_INTF (11 pins), 07 Audio (R83.2)
B_LED_0: 02 LEDs (U3.11), 09 LEDs(2) (R94.1 TP64.1)
B_LED_1: 02 LEDs (U3.9), 09 LEDs(2) (R100.1)
B_LED_2: 02 LEDs (U3.7), 09 LEDs(2) (R106.1)
B_LED_3: 02 LEDs (U3.20), 09 LEDs(2) (R112.1)
B_LED_4: 02 LEDs (U3.18), 09 LEDs(2) (R116.1)
B_LED_5: 02 LEDs (U3.17), 09 LEDs(2) (R119.1)
B_LED_6: 02 LEDs (U3.10), 09 LEDs(2) (R95.1)
B_LED_7: 02 LEDs (U3.8), 09 LEDs(2) (R101.1)
B_LED_8: 02 LEDs (U3.21), 09 LEDs(2) (R107.1)
B_LED_9: 02 LEDs (U3.19), 09 LEDs(2) (R113.1)
CAM_CLK_N: 04 DragonBoard_INTF (J4.4), 08 Camera (CAM7.8)
CAM_CLK_P: 04 DragonBoard_INTF (J4.2), 08 Camera (CAM7.9)
CAM_D0_N: 04 DragonBoard_INTF (J4.10), 08 Camera (CAM7.2)
CAM_D0_P: 04 DragonBoard_INTF (J4.8), 08 Camera (CAM7.3)
CAM_D1_N: 04 DragonBoard_INTF (J4.16), 08 Camera (CAM7.5)
CAM_D1_P: 04 DragonBoard_INTF (J4.14), 08 Camera (CAM7.6)
CAM_ENABLE: 04 DragonBoard_INTF (TP22.1 U8.14), 08 Camera (CAM7.11)
CAM_LED_EN: 04 DragonBoard_INTF (TP21.1 U8.15), 08 Camera (CAM7.12)
CDC_MIC2_P: 04 DragonBoard_INTF (C34.1 R54.1), 07 Audio (AUX6.1 C44.1 TP51.1)
CDC_MIC3_P: 04 DragonBoard_INTF (C35.1 R57.2), 07 Audio (MIC6.4 TP56.1)
CDC_MIC_BIAS1: 04 DragonBoard_INTF (J5.12 R121.2), 07 Audio (R84.2 TP55.1)
DRBD_SPKR+: 04 DragonBoard_INTF (J5.1), 07 Audio (SPKR6.1)
DRBD_SPKR-: 04 DragonBoard_INTF (J5.2), 07 Audio (SPKR7.2)
G_LED_0: 02 LEDs (U1.11), 09 LEDs(2) (R92.1 TP63.1)
G_LED_1: 02 LEDs (U1.9), 09 LEDs(2) (R98.1)
G_LED_2: 02 LEDs (U1.7), 09 LEDs(2) (R104.1)
G_LED_3: 02 LEDs (U1.20), 09 LEDs(2) (R110.1)
G_LED_4: 02 LEDs (U1.18), 09 LEDs(2) (R115.1)
G_LED_5: 02 LEDs (U1.17), 09 LEDs(2) (R118.1)
G_LED_6: 02 LEDs (U1.10), 09 LEDs(2) (R93.1)
G_LED_7: 02 LEDs (U1.8), 09 LEDs(2) (R99.1)
G_LED_8: 02 LEDs (U1.21), 09 LEDs(2) (R105.1)
G_LED_9: 02 LEDs (U1.19), 09 LEDs(2) (R111.1)
GND_CFILT: 04 DragonBoard_INTF (J5.5), 07 Audio (R86.1 TP57.1)
GYRO_INT1: 04 DragonBoard_INTF (TP23.1 U8.13), 06 Gyro (R67.2)
GYRO_INT2: 04 DragonBoard_INTF (TP26.1 U8.12), 06 Gyro (R68.1)
I2C0_SCL: 04 DragonBoard_INTF (TP15.1 U8.20), 06 Gyro (U11.13)
I2C0_SDA: 04 DragonBoard_INTF (TP17.1 U8.18), 06 Gyro (U11.14)
I2C1_SCL: 02 LEDs (U1.26 U2.26 U3.26), 04 DragonBoard_INTF (TP33.1 U9.20), 05 SERVO_FAN (U10.26)
I2C1_SDA: 02 LEDs (U1.27 U2.27 U3.27), 04 DragonBoard_INTF (TP34.1 U9.18), 05 SERVO_FAN (U10.27)
I2C2_SCL: 04 DragonBoard_INTF (TP18.1 U8.17), 08 Camera (R88.1)
I2C2_SDA: 04 DragonBoard_INTF (TP20.1 U8.16), 08 Camera (R89.1)
LED_CNTRL: 02 LEDs (R11.2 R14.2 R21.2), 04 DragonBoard_INTF (TP36.1 U9.16)
LineIn_Detect: 04 DragonBoard_INTF (R52.1), 07 Audio (R81.2 R83.1 TP54.1)
PWM_CNTRL: 04 DragonBoard_INTF (TP35.1 U9.17), 05 SERVO_FAN (R64.2)
R_LED_0: 02 LEDs (U2.11), 09 LEDs(2) (R90.1 TP62.1)
R_LED_1: 02 LEDs (U2.9), 09 LEDs(2) (R96.1)
R_LED_2: 02 LEDs (U2.7), 09 LEDs(2) (R102.1)
R_LED_3: 02 LEDs (U2.20), 09 LEDs(2) (R108.1)
R_LED_4: 02 LEDs (U2.18), 09 LEDs(2) (R114.1)
R_LED_5: 02 LEDs (U2.17), 09 LEDs(2) (R117.1)
R_LED_6: 02 LEDs (U2.10), 09 LEDs(2) (R91.1)
R_LED_7: 02 LEDs (U2.8), 09 LEDs(2) (R97.1)
R_LED_8: 02 LEDs (U2.21), 09 LEDs(2) (R103.1)
R_LED_9: 02 LEDs (U2.19), 09 LEDs(2) (R109.1)
SPI0_CLK: 04 DragonBoard_INTF (TP37.1 U9.15), 07 Audio (R74.2)
SPI0_CSn: 04 DragonBoard_INTF (TP39.1 U9.13), 07 Audio (R77.2)
SPI0_MISO: 04 DragonBoard_INTF (TP38.1 U9.14), 07 Audio (R76.2)